# Altium project PCB_Project_1.PrjPcb
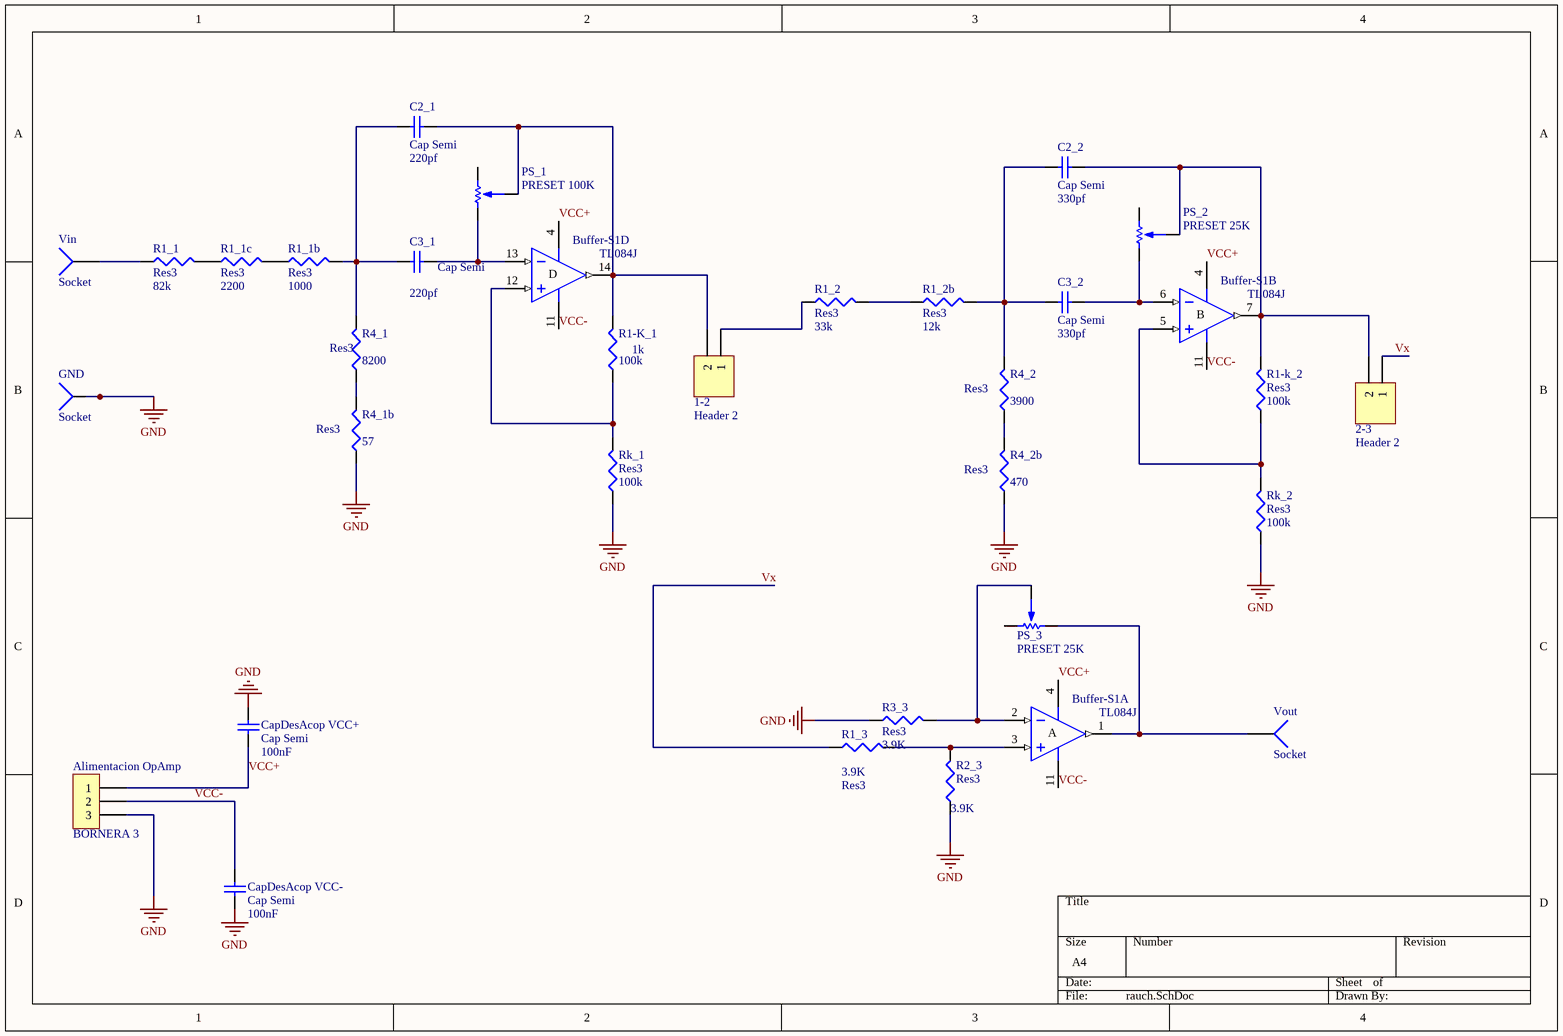
[diagram p0: rauch.SchDoc]
1 sheet, 32 parts. Net scope: global (net labels, ports and power ports of the same name join across sheets).
Board file: PCB1.PcbDoc

## Sheet rauch.SchDoc
size A4

### Parts
1-2  Header 2  [HDR1X2]
2-3  Header 2  [HDR1X2]
Alimentacion_OpAmp  BORNERA 3  [BORNERA3]
Buffer-S1  TL084J  [J014]  (parts A,B,D of 4)
C2_1  Cap Semi  value 220pf  [C0805]
C2_2  Cap Semi  value 330pf  [C0805]
C3_1  Cap Semi  value 220pf  [C0805]
C3_2  Cap Semi  value 330pf  [C0805]
CapDesAcop_VCC+  Cap Semi  value 100nF  [C0805]
CapDesAcop_VCC-  Cap Semi  value 100nF  [C0805]
GND  Socket  [PIN1]
PS_1  PRESET 100K  [PRESET V]
PS_2  PRESET 25K  [PRESET V]
PS_3  PRESET 25K  [PRESET V]
R1-K_1  1k  value 100k  [6-0805_M]
R1-k_2  Res3  value 100k  [6-0805_M]
R1_1  Res3  value 82k  [6-0805_M]
R1_1b  Res3  value 1000  [6-0805_M]
R1_1c  Res3  value 2200  [6-0805_M]
R1_2  Res3  value 33k  [6-0805_M]
R1_2b  Res3  value 12k  [6-0805_M]
R1_3  Res3  value 3.9K  [6-0805_M]
R2_3  Res3  value 3.9K  [6-0805_M]
R3_3  Res3  value 3.9K  [6-0805_M]
R4_1  Res3  value 8200  [6-0805_M]
R4_1b  Res3  value 57  [6-0805_M]
R4_2  Res3  value 3900  [6-0805_M]
R4_2b  Res3  value 470  [6-0805_M]
Rk_1  Res3  value 100k  [6-0805_M]
Rk_2  Res3  value 100k  [6-0805_M]
Vin  Socket  [PIN1]
Vout  Socket  [PIN1]

### Nets
GND: Alimentacion_OpAmp.3 CapDesAcop_VCC+.1 CapDesAcop_VCC-.1 GND.1 R2_3.1 R3_3.1 R4_1b.1 R4_2b.1 Rk_1.1 Rk_2.1
VCC+: Alimentacion_OpAmp.1 Buffer-S1.4(V+) CapDesAcop_VCC+.2
VCC-: Alimentacion_OpAmp.2 Buffer-S1.11(V-) CapDesAcop_VCC-.2
Vx: 2-3.1 R1_3.1
Net1-2_1: 1-2.1 R1_2.1
Net1-2_2: 1-2.2 Buffer-S1.14(OUT) C2_1.1 PS_1.2 R1-K_1.2
Net2-3_2: 2-3.2 Buffer-S1.7(OUT) C2_2.1 PS_2.2 R1-k_2.2
NetBuffer-S1_1: Buffer-S1.1(OUT) PS_3.3 Vout.1
NetBuffer-S1_2: Buffer-S1.2(IN-) PS_3.2 R3_3.2
NetBuffer-S1_3: Buffer-S1.3(IN+) R1_3.2 R2_3.2
NetBuffer-S1_5: Buffer-S1.5(IN+) R1-k_2.1 Rk_2.2
NetBuffer-S1_6: Buffer-S1.6(IN-) C3_2.1 PS_2.3
NetBuffer-S1_12: Buffer-S1.12(IN+) R1-K_1.1 Rk_1.2
NetBuffer-S1_13: Buffer-S1.13(IN-) C3_1.1 PS_1.3
NetC2_1_2: C2_1.2 C3_1.2 R1_1b.2 R4_1.2
NetC2_2_2: C2_2.2 C3_2.2 R1_2b.2 R4_2.2
NetR1_1_1: R1_1.1 Vin.1
NetR1_1_2: R1_1.2 R1_1c.1
NetR1_1b_1: R1_1b.1 R1_1c.2
NetR1_2_2: R1_2.2 R1_2b.1
NetR4_1_1: R4_1.1 R4_1b.2
NetR4_2_1: R4_2.1 R4_2b.2

Not connected (* = marked no-connect by the designer): PS_1 1; PS_2 1; PS_3 1

### Notes on the sheet
- (in symbol TL084J, part A) A
- (in symbol TL084J, part B) B
- (in symbol TL084J, part D) D

### Library data of the parts
1-2 2-3 = Header 2: Header, 2-Pin; LatestRevisionDate: 17-Jul-2002; LatestRevisionNote: Re-released for DXP Platform.; Publisher: Altium Limited
Buffer-S1 = TL084J: JFET-Input Operational Amplifier; Published: 16-Jan-2001; LatestRevisionDate: 04-Mar-2005; LatestRevisionNote: Stylized 3D Model Added.; DatasheetVersion: Feb-1999; PackageVersion: Jun-1999; PackageReference: J014; Publisher: Altium Limited; PackageDescription: DIP; 14 Leads; Row Spacing 7.62 mm; Pitch 2.54 mm; ComponentLink1Description: Manufacturer Link; ComponentLink1URL: http://www.ti.com/; ComponentLink2Description: Datasheet; ComponentLink2URL: http://www-s.ti.com/sc/ds/tl084.pdf
C2_1 C2_2 C3_1 C3_2 CapDesAcop_VCC+ CapDesAcop_VCC- = Cap Semi: Capacitor (Semiconductor SIM Model); Published: 8-Jun-2000; LatestRevisionDate: 29-May-2009; LatestRevisionNote: IPC-7351 Footprint Added.; PackageReference: C1206; Publisher: Altium Limited; PackageDescription: Chip Capacitor
PS_1-PS_3 = PRESET
R1-K_1 R1-k_2 R1_1 R1_1b R1_1c R1_2 R1_2b R1_3 R2_3 R3_3 R4_1 R4_1b R4_2 R4_2b Rk_1 Rk_2 = Res3: Resistor; Published: 8-Jun-2000; LatestRevisionDate: 29-May-2009; LatestRevisionNote: IPC-7351 Footprint Added.; PackageReference: J1-0603; Publisher: Altium Limited; PackageDescription: Chip Resistor
GND Vin Vout = Socket: LatestRevisionDate: 17-Jul-2002; LatestRevisionNote: Re-released for DXP Platform.; Publisher: Altium Limited